# Altium schematic sheet MKO.SchDoc
size 410 x 297 mm
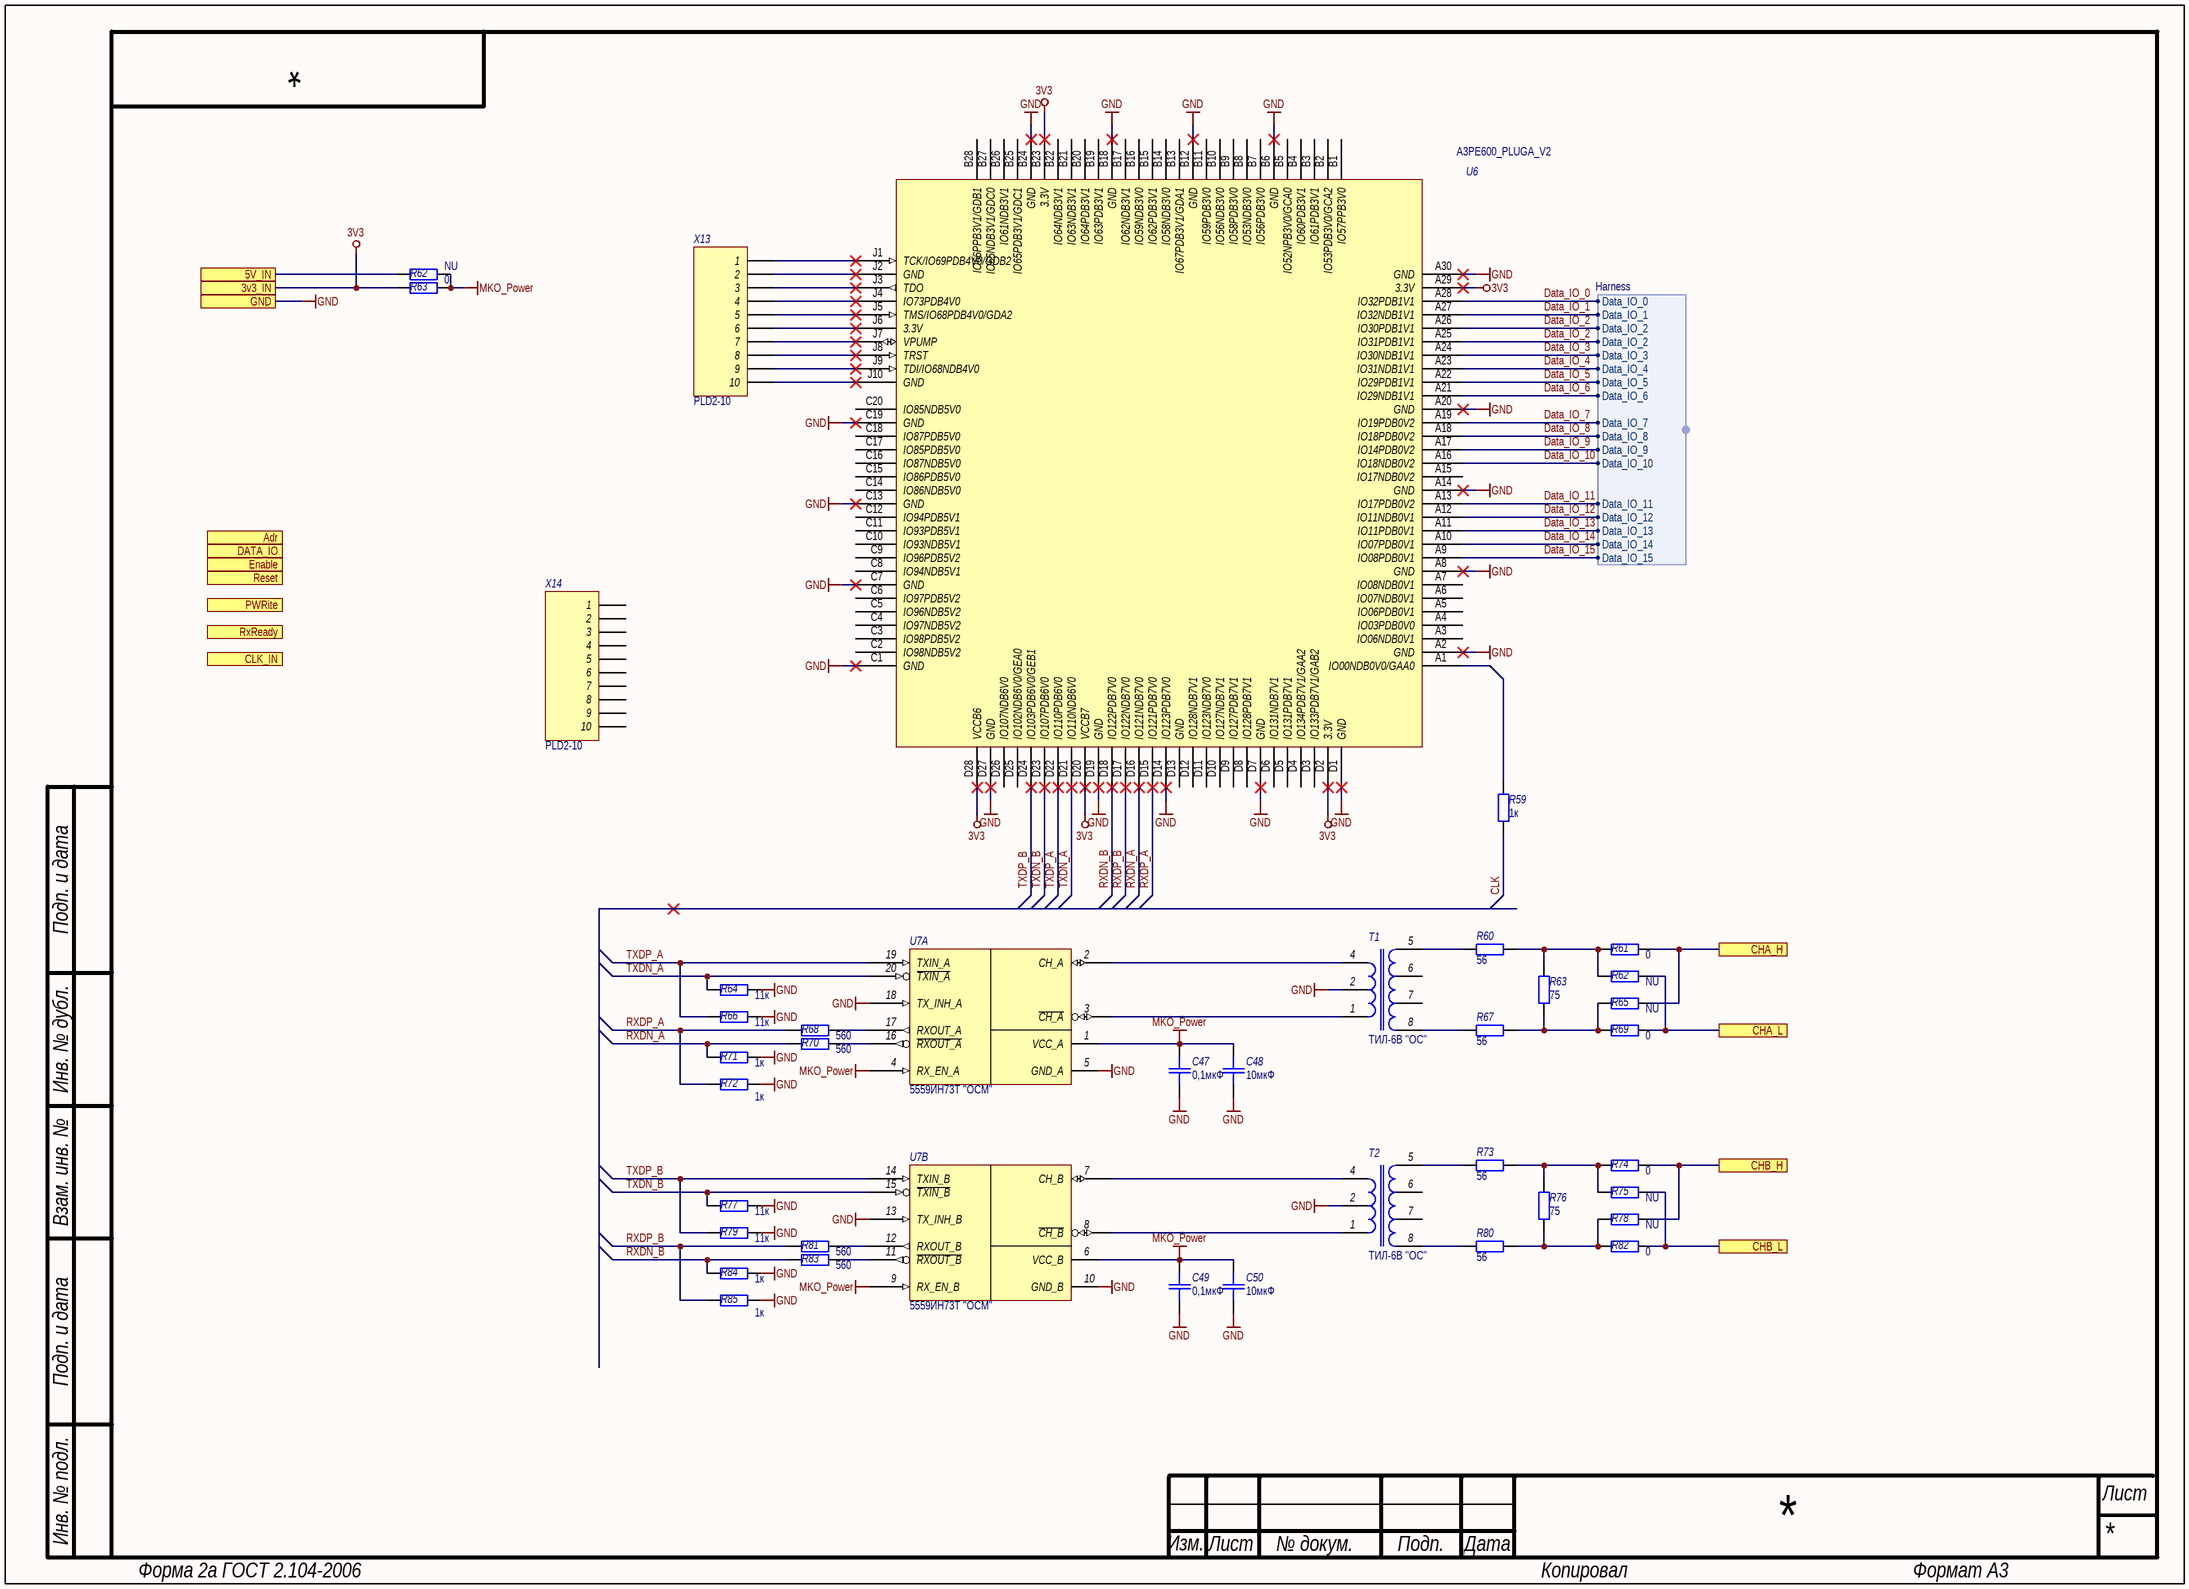
[diagram p0: MKO.SchDoc]

## Parts
(Parts that share a designator on the sheet are numbered #1, #2 ... from top to bottom, then left to right.)
C47  0,1мкФ  [SMD_0805]
C48  10мкФ  [SMD_0805]
C49  0,1мкФ  [SMD_0805]
C50  10мкФ  [SMD_0805]
R59  1к  [SMD_0805]
R60  56  [SMD_1206]
R61  0  [SMD_0805]
R62#1  NU  [SMD_0805]
R62#2  NU  [SMD_0805]
R63#1  0  [SMD_0805]
R63#2  75  [SMD_1206]
R64  11к  [SMD_0805]
R65  NU  [SMD_0805]
R66  11к  [SMD_0805]
R67  56  [SMD_1206]
R68  560  [SMD_0805]
R69  0  [SMD_0805]
R70  560  [SMD_0805]
R71  1к  [SMD_0805]
R72  1к  [SMD_0805]
R73  56  [SMD_1206]
R74  0  [SMD_0805]
R75  NU  [SMD_0805]
R76  75  [SMD_1206]
R77  11к  [SMD_0805]
R78  NU  [SMD_0805]
R79  11к  [SMD_0805]
R80  56  [SMD_1206]
R81  560  [SMD_0805]
R82  0  [SMD_0805]
R83  560  [SMD_0805]
R84  1к  [SMD_0805]
R85  1к  [SMD_0805]
T1  Наименование: ТИЛ-6В "ОС"  [TIL-6V]  (hidden comment: TIL-6V)
T2  Наименование: ТИЛ-6В "ОС"  [TIL-6V]  (hidden comment: TIL-6V)
U6  A3PE600_PLUGA_V2  [A3PE600_PLUGA_V2]
U7  Наименование: 5559ИН73Т "ОСМ"  [4153.20-6]  (hidden comment: 5559IN73T_OSM)  (parts A,B of 2)
X13  Наименование: PLD2-10  [PLD2-12]  (hidden comment: Header 2X10)
X14  Наименование: PLD2-10  [PLD2-12]  (hidden comment: Header 2X10)

## Ports
3v3_IN, 5V_IN, Adr, CHA_H, CHA_L, CHB_H, CHB_L, CLK_IN, DATA_IO, Enable, GND, PWRite, Reset, RxReady

## Harnesses
Harness: Data_IO_0, Data_IO_1, Data_IO_2, Data_IO_2, Data_IO_3, Data_IO_4, Data_IO_5, Data_IO_6, Data_IO_7, Data_IO_8, Data_IO_9, Data_IO_10, Data_IO_11, Data_IO_12, Data_IO_13, Data_IO_14, Data_IO_15

## Nets
3V3: R63#1.1 U6.A29(3.3V) U6.B23(3.3V) U6.D2(3.3V) U6.D20(VCCB7) U6.D28(VCCB6) ; port 3v3_IN
GND: C47.1 C48.1 C49.1 C50.1 R64.2 R66.2 R71.2 R72.2 R77.2 R79.2 R84.2 R85.2 T1.2 T2.2 U6.A2(GND) U6.A8(GND) U6.A14(GND) U6.A20(GND) U6.A30(GND) U6.B6(GND) U6.B12(GND) U6.B18(GND) U6.B24(GND) U6.C1(GND) U6.C7(GND) U6.C13(GND) U6.C19(GND) U6.D1(GND) U6.D7(GND) U6.D14(IO123PDB7V0) U6.D19(GND) U6.D27(GND) U7.5(GND_A) U7.10(GND_B) U7.13(TX_INH_B) U7.18(TX_INH_A) ; port GND
MKO_Power: C47.2 C48.2 C49.2 C50.2 R62#1.2 R63#1.2 U7.1(VCC_A) U7.4(RX_EN_A) U7.6(VCC_B) U7.9(RX_EN_B)
5V_IN: R62#1.1 ; port 5V_IN
CHA_H: R61.2 R65.2 ; port CHA_H
CHA_L: R62#2.2 R69.2 ; port CHA_L
CHB_H: R74.2 R78.2 ; port CHB_H
CHB_L: R75.2 R82.2 ; port CHB_L
CLK: R59.2
Data_IO_0: U6.A28(IO32PDB1V1) ; harness Harness.Data_IO_0
Data_IO_1: U6.A27(IO32NDB1V1) ; harness Harness.Data_IO_1
Data_IO_2: U6.A25(IO31PDB1V1) U6.A26(IO30PDB1V1) ; harness Harness.Data_IO_2
Data_IO_3: U6.A24(IO30NDB1V1) ; harness Harness.Data_IO_3
Data_IO_4: U6.A23(IO31NDB1V1) ; harness Harness.Data_IO_4
Data_IO_5: U6.A22(IO29PDB1V1) ; harness Harness.Data_IO_5
Data_IO_6: U6.A21(IO29NDB1V1) ; harness Harness.Data_IO_6
Data_IO_7: U6.A19(IO19PDB0V2) ; harness Harness.Data_IO_7
Data_IO_8: U6.A18(IO18PDB0V2) ; harness Harness.Data_IO_8
Data_IO_9: U6.A17(IO14PDB0V2) ; harness Harness.Data_IO_9
Data_IO_10: U6.A16(IO18NDB0V2) ; harness Harness.Data_IO_10
Data_IO_11: U6.A13(IO17PDB0V2) ; harness Harness.Data_IO_11
Data_IO_12: U6.A12(IO11NDB0V1) ; harness Harness.Data_IO_12
Data_IO_13: U6.A11(IO11PDB0V1) ; harness Harness.Data_IO_13
Data_IO_14: U6.A10(IO07PDB0V1) ; harness Harness.Data_IO_14
Data_IO_15: U6.A9(IO08PDB0V1) ; harness Harness.Data_IO_15
RXDN_A: R70.2 R71.1 U6.D16(IO121NDB7V0)
RXDN_B: R83.2 R84.1 U6.D18(IO122PDB7V0)
RXDP_A: R68.2 R72.1 U6.D15(IO121PDB7V0)
RXDP_B: R81.2 R85.1 U6.D17(IO122NDB7V0)
TXDN_A: R64.1 U6.D21(IO110NDB6V0) U7.20(~{TXIN_A})
TXDN_B: R77.1 U6.D23(IO107PDB6V0) U7.15(~{TXIN_B})
TXDP_A: R66.1 U6.D22(IO110PDB6V0) U7.19(TXIN_A)
TXDP_B: R79.1 U6.D24(IO103PDB6V0/GEB1) U7.14(TXIN_B)
NetR59_1: R59.1 U6.A1(IO00NDB0V0/GAA0)
NetR60_1: R60.1 T1.5
NetR60_2: R60.2 R61.1 R62#2.1 R63#2.2
NetR63#2_1: R63#2.1 R65.1 R67.2 R69.1
NetR67_1: R67.1 T1.8
NetR68_1: R68.1 U7.17(RXOUT_A)
NetR70_1: R70.1 U7.16(~{RXOUT_A})
NetR73_1: R73.1 T2.5
NetR73_2: R73.2 R74.1 R75.1 R76.2
NetR76_1: R76.1 R78.1 R80.2 R82.1
NetR80_1: R80.1 T2.8
NetR81_1: R81.1 U7.12(RXOUT_B)
NetR83_1: R83.1 U7.11(~{RXOUT_B})
NetT1_1: T1.1 U7.3(~{CH_A})
NetT1_4: T1.4 U7.2(CH_A)
NetT2_1: T2.1 U7.8(~{CH_B})
NetT2_4: T2.4 U7.7(CH_B)
NetU6_J1: U6.J1(TCK/IO69PDB4V0/GDB2) X13.1
NetU6_J2: U6.J2(GND) X13.2
NetU6_J3: U6.J3(TDO) X13.3
NetU6_J4: U6.J4(IO73PDB4V0) X13.4
NetU6_J5: U6.J5(TMS/IO68PDB4V0/GDA2) X13.5
NetU6_J6: U6.J6(3.3V) X13.6
NetU6_J7: U6.J7(VPUMP) X13.7
NetU6_J8: U6.J8(TRST) X13.8
NetU6_J9: U6.J9(TDI/IO68NDB4V0) X13.9
NetU6_J10: U6.J10(GND) X13.10

Not connected (* = marked no-connect by the designer): T1 6 7; T2 6 7; U6 A3(IO06NDB0V1) A4(IO03PDB0V0) A5(IO06PDB0V1) A6(IO07NDB0V1) A7(IO08NDB0V1) A15(IO17NDB0V2) B1(IO57PPB3V0) B2(IO53PDB3V0/GCA2) B3(IO61PDB3V1) B4(IO60PDB3V1) B5(IO52NPB3V0/GCA0) B7(IO56PDB3V0) B8(IO53NDB3V0) B9(IO58PDB3V0) B10(IO56NDB3V0) B11(IO59PDB3V0) B13(IO67PDB3V1/GDA1) B14(IO58NDB3V0) B15(IO62PDB3V1) B16(IO59NDB3V0) B17(IO62NDB3V1) B19(IO63PDB3V1) B20(IO64PDB3V1) B21(IO63NDB3V1) B22(IO64NDB3V1) B25(IO65PDB3V1/GDC1) B26(IO61NDB3V1) B27(IO65NDB3V1/GDC0) B28(IO66PPB3V1/GDB1) C2(IO98NDB5V2) C3(IO98PDB5V2) C4(IO97NDB5V2) C5(IO96NDB5V2) C6(IO97PDB5V2) C8(IO94NDB5V1) C9(IO96PDB5V2) C10(IO93NDB5V1) C11(IO93PDB5V1) C12(IO94PDB5V1) C14(IO86NDB5V0) C15(IO86PDB5V0) C16(IO87NDB5V0) C17(IO85PDB5V0) C18(IO87PDB5V0) C20(IO85NDB5V0) D3(IO133PDB7V1/GAB2) D4(IO134PDB7V1/GAA2) D5(IO131PDB7V1) D6(IO131NDB7V1) D8(IO128PDB7V1) D9(IO127PDB7V1) D10(IO127NDB7V1) D11(IO123NDB7V0) D12(IO128NDB7V1) D13(GND) D25(IO102NDB6V0/GEA0) D26(IO107NDB6V0); X14 1 2 3 4 5 6 7 8 9 10

## Notes on the sheet
- Подп. и дата
- Инв. № дубл.
- Взам. инв. №
- Инв. № подл.
- Изм.
- Лист
- № докум.
- Подп.
- Дата
- Форма 2а ГОСТ 2.104-2006
- Копировал
- Формат А3

## Library data of the parts
C47 C49 = Capacitor: Назначение: SMD-конденсатор; Наименование: Конденсатор; Потребление, Вт: 0; Value: 0,1мкФ
C48 C50 = Capacitor: Назначение: SMD-конденсатор; Наименование: Конденсатор; Потребление, Вт: 0; Value: 0,1мкФ
R59 R71 R72 R84 R85 = Resistor: Наименование: Резистор; Назначение: SMD-резистор; Потребление, Вт: 0,001; Value: 1к
R60 R61 R62#1 R62#2 R63#1 R63#2 R64-R70 R73-R83 = Resistor: Наименование: Резистор; Назначение: SMD-резистор; Потребление, Вт: 0,001; Value: 1к
T1 T2 = TIL-6V: Импульсный трансформатор; Назначение: Импульсный трансформатор МПИ; Потребление, Вт: 0.0
U6 = A3PE600_PLUGA_V2: Назначение: A3PE600 - мезанин; Наименование: A3PE600; Потребление, Вт: *
U7 = 5559IN73T: Приемопередатчики манчестерского кода; Назначение: Приемопередатчик манчестерского кода; Потребление, Вт: 0.1; ComponentLink1Description: DataSheet; ComponentLink1URL: https://www.integral.by/sites/default/files/pdf/23_specifikaciya_5559in73t-74t.pdf
X13 X14 = Header, 10-Pin, Single row SCH Dual row PCB: Потребление, Вт: 0,0; Назначение: Header, 10-Pin, Single row SCH Dual row PCB